# Altium schematic sheet power.SchDoc
size A4; SheetNumber: 10; SheetTotal: 10
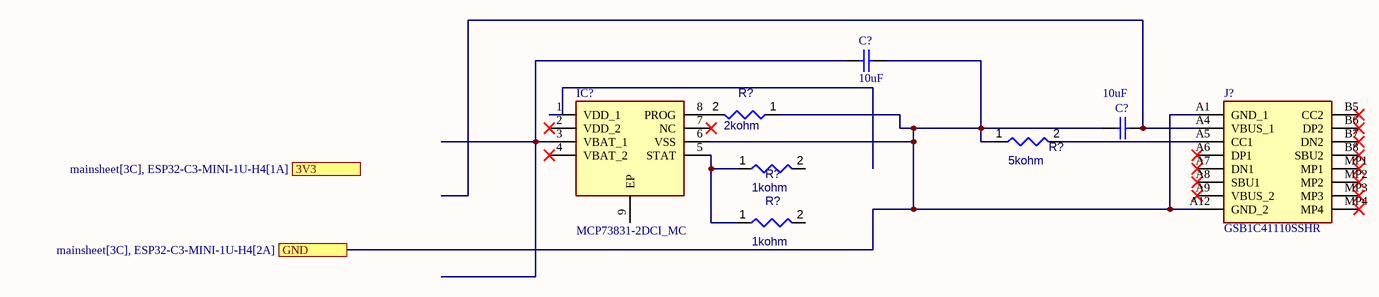
[diagram p0: power.SchDoc]

## Parts
(Parts that share a designator on the sheet are numbered #1, #2 ... from top to bottom, then left to right.)
C?#1  10uF  [CAPC1608X90X35ML10T15]
C?#2  10uF  [CAPC1608X90X35ML10T15]
IC?  MCP73831-2DCI_MC  [SON50P300X200X100-9N-D]
J?  GSB1C41110SSHR  [GSB1C41110SSHR]
R?#1  2kohm
R?#2  5kohm
R?#3  1kohm
R?#4  1kohm

## Ports
3V3 (see mainsheet[3C], ESP32-C3-MINI-1U-H4[1A]), GND (see mainsheet[3C], ESP32-C3-MINI-1U-H4[2A])

## Nets
GND: C?#1.1 C?#2.2 IC?.6(VSS) J?.A1(GND_1) J?.A12(GND_2) R?#1.1 R?#2.1 ; port GND
NetC?#1_2: C?#1.2 IC?.3(VBAT_1)
NetC?#2_1: C?#2.1 J?.A4(VBUS_1)
NetIC?_5: IC?.5(STAT) R?#3.1 R?#4.1
NetIC?_8: IC?.8(PROG) R?#1.2
NetJ?_A5: J?.A5(CC1) R?#2.2

Not connected (* = marked no-connect by the designer): IC? 1(VDD_1) 2(VDD_2)* 4(VBAT_2)* 7(NC)* 9(EP); J? A6(DP1)* A7(DN1)* A8(SBU1)* A9(VBUS_2)* B5(CC2)* B6(DP2)* B7(DN2)* B8(SBU2)* MP1* MP2* MP3* MP4*; R?#3 2; R?#4 2

## Library data of the parts
C?#1 C?#2 = CMP-2100-03643-1: Chip Capacitor, 0.1 uF, +/- 10%, 50 V, -55 to 125 degC, 0603 (1608 Metric), RoHS, Tape and Reel; Manufacturer: Murata; Dielectric Material: Ceramic; Voltage Rating: 50V; Capacitance: 100nF; Dielectric: X7R; Insulation Resistance: 10GR; Case Code (Metric): 1608; Lead Free: LeadFree; Depth: 0.8mm; Number of Pins: 2; Radiation Hardening: No; Case/Package: 0603; Manufacturer URL: http://www.murata.com/; Packaging: TapeandReel; Length: 1.6mm; Contact Plating: Tin; Datasheet URL: http://psearch.en.murata.com/capacitor/product/GRM188R71H104KA93%23.pdf; Tolerance: 10%; Case Code (Imperial): 0603; Min Operating Temperature: -55degC; RoHSCompliant: true; Voltage: 50V; Termination: SMD/SMT; Mount: SurfaceMount; Material: Ceramic; Package Quantity: 1; Height: 0.8mm; Thickness: 0.035inch; REACH SVHC: NoSVHC; Max Operating Temperature: 125degC; Width: 0.8mm; Package Reference: 0603; Voltage Rating (DC): 50V; Datasheet Version: 42675.0; Package Description: 2-Pin Surface Mount Device, Body 1.6 x 0.8 mm
IC? = MCP73831-2DCI_MC: Integrated Circuit; Manufacturer_Name: Microchip; Manufacturer_Part_Number: MCP73831-2DCI/MC; Datasheet Link: https://www.arrow.com/en/products/mcp73831-2dcimc/microchip-technology; Height: 1mm; Mouser Part Number: 579-MCP73831-2DCI/MC; Mouser Price/Stock: https://www.mouser.co.uk/ProductDetail/Microchip-Technology/MCP73831-2DCI-MC?qs=hH%252BOa0VZEiBQ%2FrptDRXKdg%3D%3D; Arrow Part Number: MCP73831-2DCI/MC; Arrow Price/Stock: https://www.arrow.com/en/products/mcp73831-2dcimc/microchip-technology?region=nac
J? = GSB1C41110SSHR: Connector; Manufacturer_Name: Amphenol Communications Solutions; Datasheet Link: https://cdn.amphenol-cs.com/media/wysiwyg/files/drawing/gsb1c41x10sshr-ax1.pdf; Height: 3.41mm; Manufacturer_Part_Number: GSB1C41110SSHR
R?#1-R?#4 = Resistors: Resistor; Value: 4.7kohm; Case/Package: 0402; Component Type: Resistors